# Altium schematic sheet Terminal.SchDoc
size A4
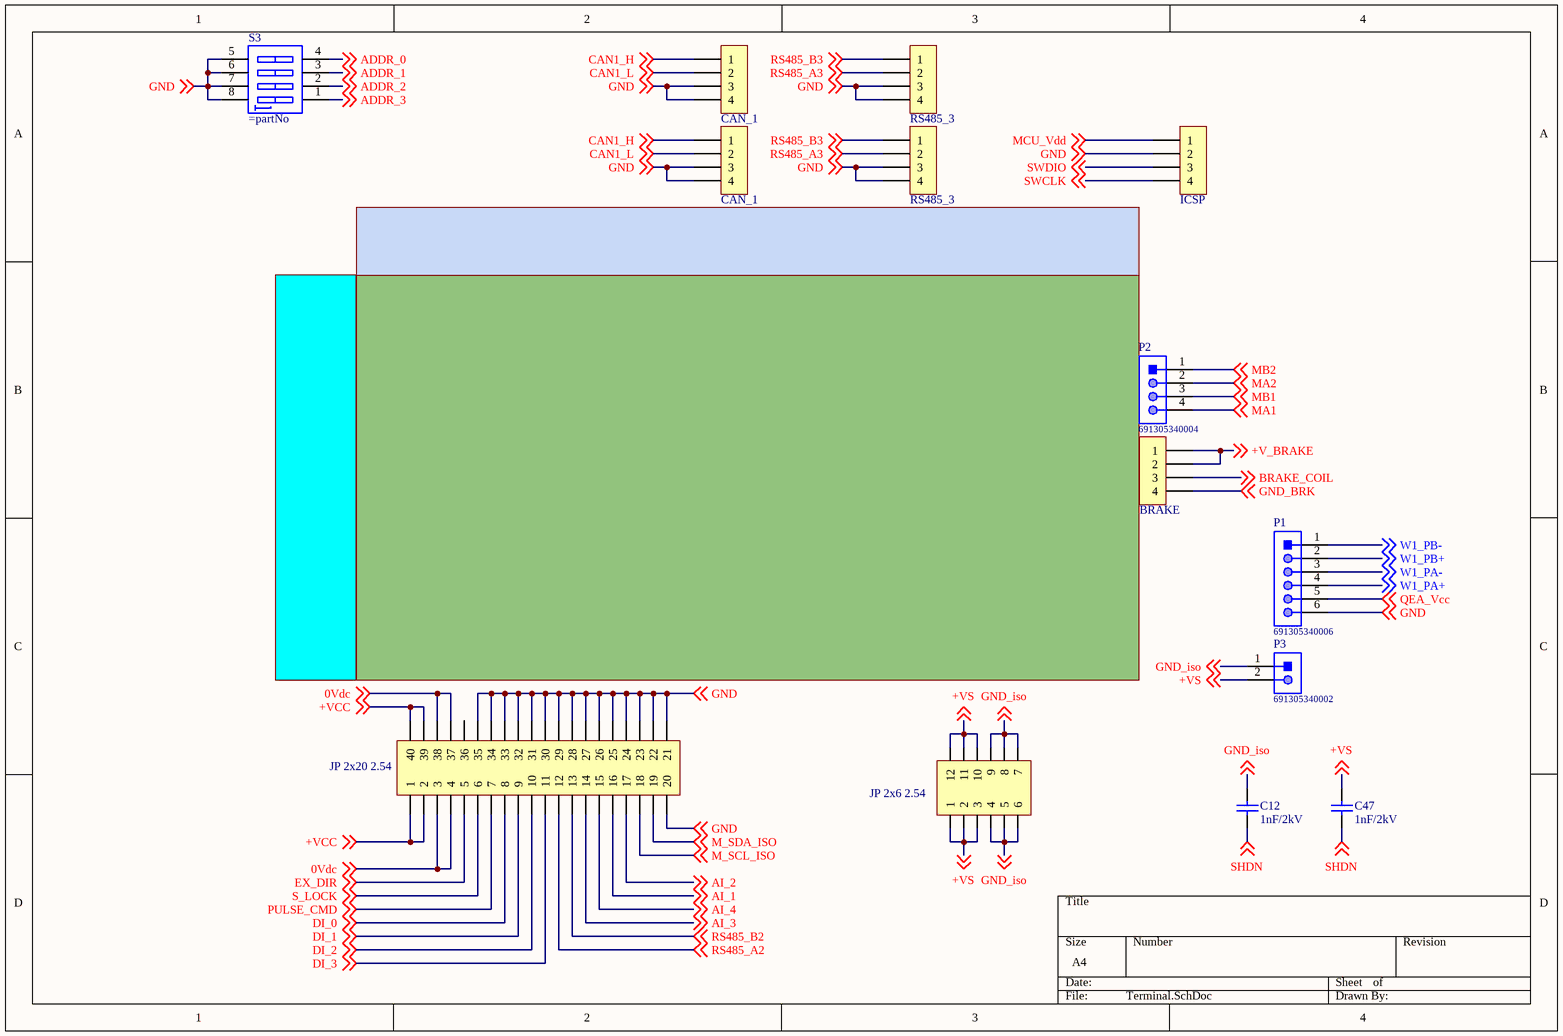
[diagram p0: Terminal.SchDoc]

## Parts
C12  1nF/2kV  [Cap 3KV 5mm]
C47  1nF/2kV  [Cap 3KV 5mm]
H1  CAN_1  [Header 4P DC 2.54]
H2  RS485_3  [Header 4P DC 2.54]
H4  ICSP  [Header 4P DC 2.54]
H5  BRAKE  [Header 4P DC 2.54]
H6  CAN_1  [Header 4P DC 2.54]
H8  RS485_3  [Header 4P DC 2.54]
JP1  JP 2x20 2.54  [JP 2x20 DC]
JP2  JP 2x6 2.54  [JP 2x6 DC]
P1  691305340006  [691305340006]
P2  691305340004  [691305340004]
P3  691305340002  [691305340002]
S3  (no value)  [SW-DIP4]

## Nets
0Vdc: JP1.3 JP1.4 JP1.37 JP1.38 ; off-sheet 0Vdc
+V_BRAKE: H5.1 H5.2 ; off-sheet +V_BRAKE
+VCC: JP1.1 JP1.2 JP1.39 JP1.40 ; off-sheet +VCC
+VS: C47.2 JP2.1 JP2.2 JP2.3 JP2.10 JP2.11 JP2.12 P3.2 ; off-sheet +VS
ADDR_0: S3.4 ; off-sheet ADDR_0
ADDR_1: S3.3 ; off-sheet ADDR_1
ADDR_2: S3.2 ; off-sheet ADDR_2
ADDR_3: S3.1 ; off-sheet ADDR_3
AI_1: JP1.16 ; off-sheet AI_1
AI_2: JP1.17 ; off-sheet AI_2
AI_3: JP1.14 ; off-sheet AI_3
AI_4: JP1.15 ; off-sheet AI_4
BRAKE_COIL: H5.3 ; off-sheet BRAKE_COIL
CAN1_H: H1.1 H6.1 ; off-sheet CAN1_H
CAN1_L: H1.2 H6.2 ; off-sheet CAN1_L
DI_0: JP1.8 ; off-sheet DI_0
DI_1: JP1.9 ; off-sheet DI_1
DI_2: JP1.10 ; off-sheet DI_2
DI_3: JP1.11 ; off-sheet DI_3
EX_DIR: JP1.5 ; off-sheet EX_DIR
GND: H1.3 H1.4 H2.3 H2.4 H4.2 H6.3 H6.4 H8.3 H8.4 JP1.20 JP1.21 JP1.22 JP1.23 JP1.24 JP1.25 JP1.26 JP1.27 JP1.28 JP1.29 JP1.30 JP1.31 JP1.32 JP1.33 JP1.34 JP1.35 P1.6 S3.5 S3.6 S3.7 S3.8 ; off-sheet GND
GND_BRK: H5.4 ; off-sheet GND_BRK
GND_iso: C12.2 JP2.4 JP2.5 JP2.6 JP2.7 JP2.8 JP2.9 P3.1 ; off-sheet GND_iso
M_SCL_ISO: JP1.18 ; off-sheet M_SCL_ISO
M_SDA_ISO: JP1.19 ; off-sheet M_SDA_ISO
MA1: P2.4 ; off-sheet MA1
MA2: P2.2 ; off-sheet MA2
MB1: P2.3 ; off-sheet MB1
MB2: P2.1 ; off-sheet MB2
MCU_Vdd: H4.1 ; off-sheet MCU_Vdd
PULSE_CMD: JP1.7 ; off-sheet PULSE_CMD
QEA_Vcc: P1.5 ; off-sheet QEA_Vcc
RS485_A2: JP1.12 ; off-sheet RS485_A2
RS485_A3: H2.2 H8.2 ; off-sheet RS485_A3
RS485_B2: JP1.13 ; off-sheet RS485_B2
RS485_B3: H2.1 H8.1 ; off-sheet RS485_B3
S_LOCK: JP1.6 ; off-sheet S_LOCK
SHDN: C12.1 C47.1 ; off-sheet SHDN
SWCLK: H4.4 ; off-sheet SWCLK
SWDIO: H4.3 ; off-sheet SWDIO
W1_PA+: P1.4 ; off-sheet W1_PA+
W1_PA-: P1.3 ; off-sheet W1_PA-
W1_PB+: P1.2 ; off-sheet W1_PB+
W1_PB-: P1.1 ; off-sheet W1_PB-

Not connected (* = marked no-connect by the designer): JP1 36

## Library data of the parts
C12 C47 = Cap: Capacitor; Published: 8-Jun-2000; LatestRevisionDate: 17-Jul-2002; LatestRevisionNote: Re-released for DXP Platform.; PackageReference: RAD-0.3; Publisher: Altium Limited; Value: 1nF/2kV
H1 H2 H4-H6 H8 = Header 4P 2.54 Duc Cong: Cắm; Ten_Linh_Kien: Header 4P XH2.54-4P Đực Cong; Don_Vi: Con; Ma_Hang: MH001310; Chung_Loai: Cắm
JP1 = JP 2x20 2.54 Duc Cong: Cắm; Ten_Linh_Kien: Jump Đôi Đực 2.54MM 2x40P Cong; Don_Vi: Con; Ma_Hang: MH005385; Ghi_Chu: *; Kieu_Chan: *; Chung_Loai: Cắm
JP2 = JP 2x6 2.54 Duc Cong: Cắm; Ten_Linh_Kien: Jump Đôi Đực 2.54MM 2x40P Cong; Don_Vi: Con; Ma_Hang: MH005385; Ghi_Chu: *; Kieu_Chan: *; Chung_Loai: Cắm
P1 = 691305340006: Serie 3053 - 3.81mm Horizontal PCB Header with Plastic Latch WR-TBL, 6 pin; Pin Number: 6; Gender: Male; ComponentLink1Description: Manufacturer; ComponentLink1URL: http://www.we-online.de; ComponentLink2Description: Datasheet; ComponentLink2URL: http://katalog.we-online.de/em/datasheet/691305340006.pdf; Part Number: 691305340006; Published Date: June 2018; Publisher: Wurth Elektronik; Pitch: 3.81 mm; Operating Temperature: -40 to 105 degC; Mounting Technology: THT; Packaging: Box
P2 = 691305340004: Serie 3053 - 3.81mm Horizontal PCB Header with Plastic Latch WR-TBL, 4 pin; Pin Number: 4; Gender: Male; ComponentLink1Description: Manufacturer; ComponentLink1URL: http://www.we-online.de; ComponentLink2Description: Datasheet; ComponentLink2URL: http://katalog.we-online.de/em/datasheet/691305340004.pdf; Part Number: 691305340004; Published Date: June 2018; Publisher: Wurth Elektronik; Pitch: 3.81 mm; Operating Temperature: -40 to 105 degC; Mounting Technology: THT; Packaging: Box
P3 = 691305340002: Serie 3053 - 3.81mm Horizontal PCB Header with Plastic Latch WR-TBL, 2 pin; Pin Number: 2; Gender: Male; ComponentLink1Description: Manufacturer; ComponentLink1URL: http://www.we-online.de; ComponentLink2Description: Datasheet; ComponentLink2URL: http://katalog.we-online.de/em/datasheet/691305340002.pdf; Part Number: 691305340002; Published Date: June 2018; Publisher: Wurth Elektronik; Pitch: 3.81 mm; Operating Temperature: -40 to 105 degC; Mounting Technology: THT; Packaging: Box
S3 = SWDIP4: WS-DITV 2.54 mm small compact THT flat actuator with top tape; Manufacturer: Wurth Elektronik; Part No.: 418127160904; ComponentLink1 Description: Manufacturer; ComponentLink2 Description: Datasheet; Pole: 04; Created Date: Dec.2015; ComponentLink1URL: http://www.we-online.com; ComponentLink2URL: http://katalog.we-online.de/em/datasheet/4181271609xx.pdf; Created by: Baojun Chen